# EasyEDA Pro project GD32F103C8T6 最小系统.eprj

# Schematic Schematic1
Create Date: 2024-03-24; Page Name: P1; Project Name: GD32F103C8T6 最小系统; Schematic Name: Schematic1; Update Date: 2024-04-14; Company: University of Leeds; Drawed: Junnan Liu; Page Size: A4; Version: V1.0
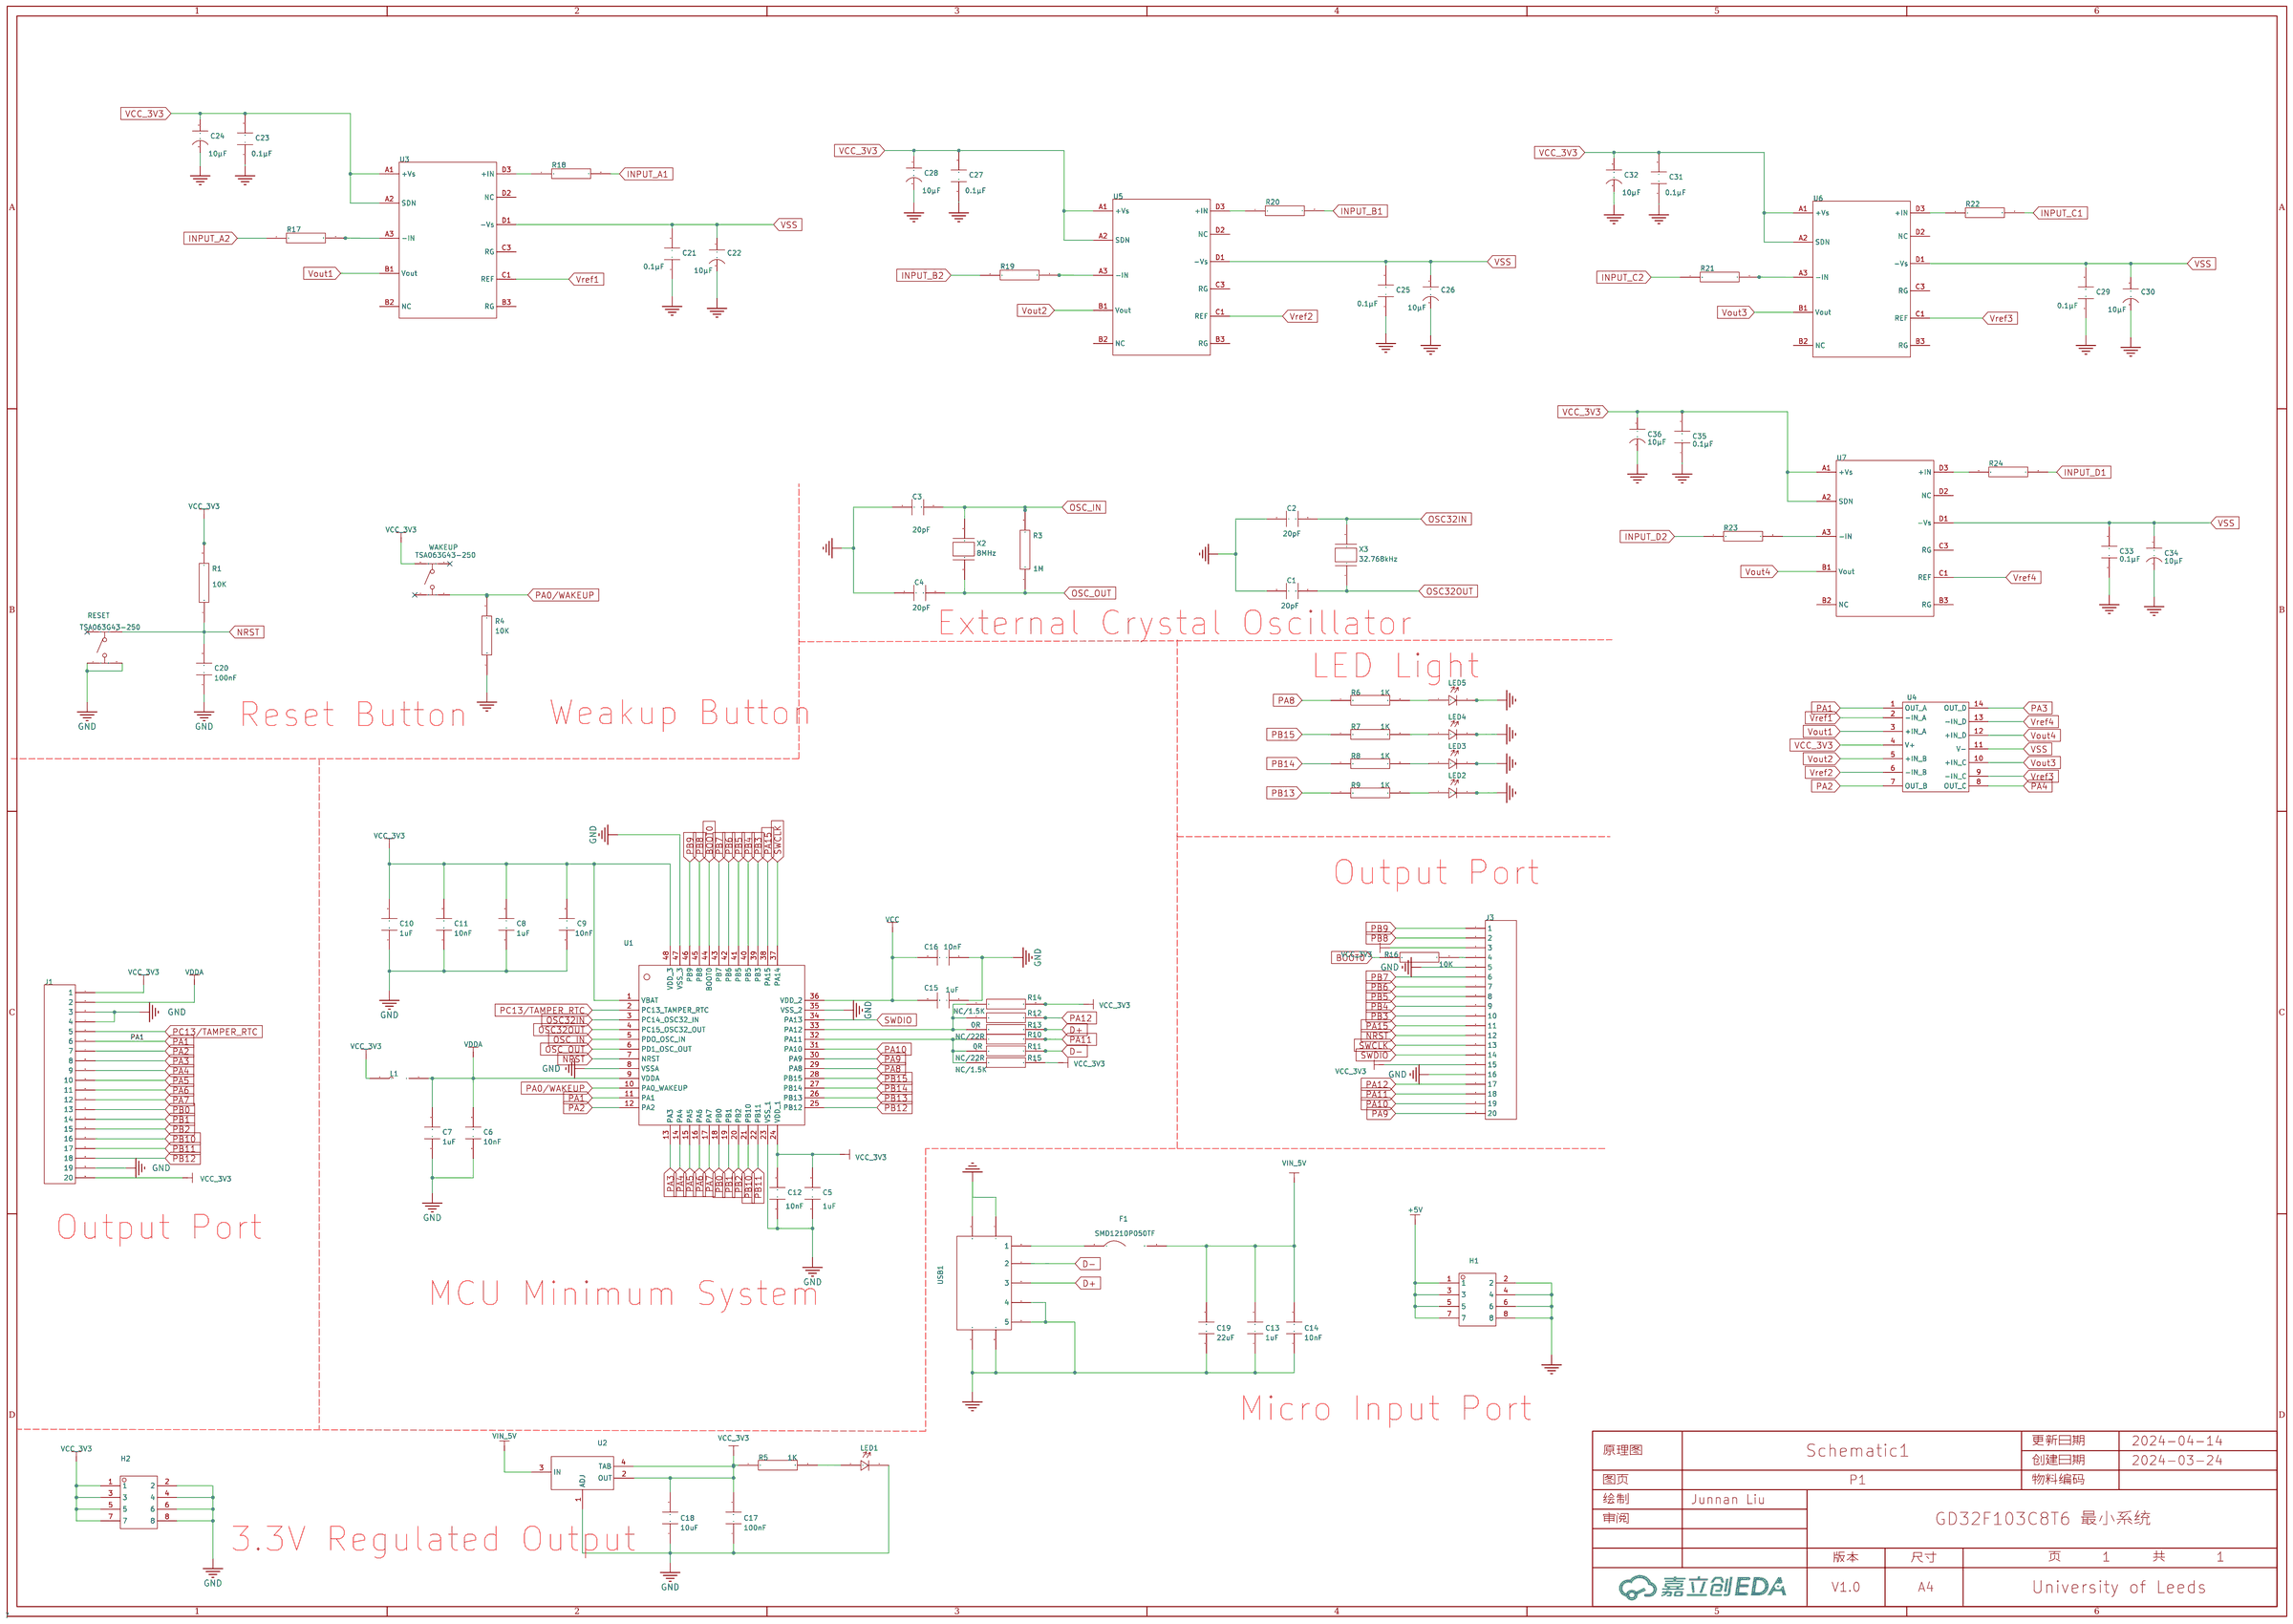
[diagram p0: schematic sheet]

## Parts
C1  20pF
C2  20pF
C3  20pF
C4  20pF
C5  1uF
C6  10nF
C7  1uF
C8  1uF
C9  10nF
C10  1uF
C11  10nF
C12  10nF
C13  1uF
C14  10nF
C15  1uF
C16  10nF
C17  100nF
C18  10uF
C19  22uF
C20  100nF
C21  0.1μF
C22  10μF
C23  0.1μF
C24  10μF
C25  0.1μF
C26  10μF
C27  0.1μF
C28  10μF
C29  0.1μF
C30  10μF
C31  0.1μF
C32  10μF
C33  0.1μF
C34  10μF
C35  0.1μF
C36  10μF
F1  SMD1210P050TF
H1  -
H2  -
J1  -
J3  -
L1  -
LED1  -
LED2  -
LED3  -
LED4  -
LED5  -
R1  10K
R3  1M
R4  10K
R5  1K
R6  1K
R7  1K
R8  1K
R9  1K
R10  0R
R11  NC/22R
R12  0R
R13  NC/22R
R14  NC/1.5K
R15  NC/1.5K
R16  10K
R17  -
R18  -
R19  -
R20  -
R21  -
R22  -
R23  -
R24  -
RESET  TSA063G43-250
U1  -
U2  -
U3  -
U4  -
U5  -
U6  -
U7  -
USB1  -
WAKEUP  TSA063G43-250
X2  8MHz
X3  32.768kHz

## Library data of the parts
C1-C21 C23 C25 C27 C29 C31 C33 C35 = C
C22 C24 C26 C28 C30 C32 C34 C36 = C1
F1 = F
H1 H2 = PZ254V-12-8P
J1 J3 = EXPIN_20
L1 = 3.3uH
LED1-LED5 = LED
R1 R3-R24 = R
RESET WAKEUP = KEY
U1 = GD32F103C876
U2 = AMS1117-3.3
U3 U5-U7 = AD8235
U4 = AD8619
USB1 = U-F-M5DD-Y-1
X2 X3 = 晶振

## Nets
+5V: H1.1 H1.3 H1.5 H1.7
GND: C1.1 C2.1 C3.1 C4.1 C5.1 C6.1 C7.1 C8.1 C9.1 C10.1 C11.1 C12.1 C13.1 C14.1 C15.1 C16.1 C17.1 C18.1 C19.1 C20.1 C21.1 C22.2 C23.1 C24.2 C25.1 C26.2 C27.1 C28.2 C29.1 C30.2 C31.1 C32.2 C33.1 C34.2 C35.1 C36.2 H1.2 H1.4 H1.6 H1.8 H2.2 H2.4 H2.6 H2.8 J1.3 J1.4 J1.19 J3.5 J3.16 LED1.2 LED2.2 LED3.2 LED4.2 LED5.2 R4.1(R-) RESET.3 RESET.4 U1.8(VSSA) U1.23(VSS_1) U1.35(VSS_2) U1.47(VSS_3) U2.1(ADJ) USB1.4 USB1.5 USB1.6 USB1.7 USB1.8 USB1.9
VCC: C15.2 C16.2 U1.36(VDD_2)
VCC_3V3: C5.2 C8.2 C9.2 C10.2 C11.2 C12.2 C17.2 C18.2 C23.2 C24.1 C27.2 C28.1 C31.2 C32.1 C35.2 C36.1 H2.1 H2.3 H2.5 H2.7 J1.1 J1.20 J3.3 J3.15 L1.1 R1.2(R+) R5.1(R-) R14.2(R+) R15.2(R+) U1.1(VBAT) U1.24(VDD_1) U1.48(VDD_3) U2.2(OUT) U2.4(TAB) U3.A1(+Vs) U3.A2(SDN) U4.4(V+) U5.A1(+Vs) U5.A2(SDN) U6.A1(+Vs) U6.A2(SDN) U7.A1(+Vs) U7.A2(SDN) WAKEUP.2
VDDA: C6.2 C7.2 J1.2 L1.2 U1.9(VDDA)
VIN_5V: C13.2 C14.2 C19.2 F1.2 U2.3(IN)
VSS: C21.2 C22.1 C25.2 C26.1 C29.2 C30.1 C33.2 C34.1 U3.D1(-Vs) U4.11(V-) U5.D1(-Vs) U6.D1(-Vs) U7.D1(-Vs)
BOOT0: R16.1(R-) U1.44(BOOT0)
D+: R13.2(R+) USB1.3
D-: R11.2(R+) USB1.2
INPUT_A1: R18.2(R+)
INPUT_A2: R17.1(R-)
INPUT_B1: R20.2(R+)
INPUT_B2: R19.1(R-)
INPUT_C1: R22.2(R+)
INPUT_C2: R21.1(R-)
INPUT_D1: R24.2(R+)
INPUT_D2: R23.1(R-)
NRST: C20.2 J3.12 R1.1(R-) RESET.1 U1.7(NRST)
OSC32IN: C2.2 U1.3(PC14_OSC32_IN) X3.2
OSC32OUT: C1.2 U1.4(PC15_OSC32_OUT) X3.1
OSC_IN: C3.2 R3.2(R+) U1.5(PDO_OSC_IN) X2.2
OSC_OUT: C4.2 R3.1(R-) U1.6(PD1_OSC_OUT) X2.1
PA0/WAKEUP: R4.2(R+) U1.10(PA0_WAKEUP) WAKEUP.3
PA1: J1.6 U1.11(PA1) U4.1(OUT A)
PA2: J1.7 U1.12(PA2) U4.7(OUT B)
PA3: J1.8 U1.13(PA3) U4.14(OUT D)
PA4: J1.9 U1.14(PA4) U4.8(OUT C)
PA5: J1.10 U1.15(PA5)
PA6: J1.11 U1.16(PA6)
PA7: J1.12 U1.17(PA7)
PA8: R6.1(R-) U1.29(PA8)
PA9: J3.20 U1.30(PA9)
PA10: J3.19 U1.31(PA10)
PA11: J3.18 R10.2(R+)
PA12: J3.17 R12.2(R+)
PA15: J3.11 U1.38(PA15)
PB0: J1.13 U1.18(PB0)
PB1: J1.14 U1.19(PB1)
PB2: J1.15 U1.20(PB2)
PB3: J3.10 U1.39(PB3)
PB4: J3.9 U1.40(PB5)
PB5: J3.8 U1.41(PB5)
PB6: J3.7 U1.42(PB6)
PB7: J3.6 U1.43(PB7)
PB8: J3.2 U1.45(PB8)
PB9: J3.1 U1.46(PB9)
PB10: J1.16 U1.21(PB10)
PB11: J1.17 U1.22(PB11)
PB12: J1.18 U1.25(PB12)
PB13: R9.1(R-) U1.26(PB13)
PB14: R8.1(R-) U1.27(PB14)
PB15: R7.1(R-) U1.28(PB15)
PC13/TAMPER_RTC: J1.5 U1.2(PC13_TAMPER_RTC)
SWCLK: J3.13 U1.37(PA14)
SWDIO: J3.14 U1.34(PA13)
Vout1: U3.B1(Vout) U4.3(+IN A)
Vout2: U4.5(+IN B) U5.B1(Vout)
Vout3: U4.10(+IN C) U6.B1(Vout)
Vout4: U4.12(+IN D) U7.B1(Vout)
Vref1: U3.C1(REF) U4.2(-IN A)
Vref2: U4.6(-IN B) U5.C1(REF)
Vref3: U4.9(-IN C) U6.C1(REF)
Vref4: U4.13(-IN D) U7.C1(REF)
Net-(F1-1): F1.1 USB1.1
Net-(J3-4): J3.4 R16.2(R+)
Net-(LED1-1): LED1.1 R5.2(R+)
Net-(LED2-1): LED2.1 R9.2(R+)
Net-(LED3-1): LED3.1 R8.2(R+)
Net-(LED4-1): LED4.1 R7.2(R+)
Net-(LED5-1): LED5.1 R6.2(R+)
Net-(R10-1): R10.1(R-) R11.1(R-) R15.1(R-) U1.32(PA11)
Net-(R12-1): R12.1(R-) R13.1(R-) R14.1(R-) U1.33(PA12)
Net-(R17-2): R17.2(R+) U3.A3(-IN)
Net-(R18-1): R18.1(R-) U3.D3(+IN)
Net-(R19-2): R19.2(R+) U5.A3(-IN)
Net-(R20-1): R20.1(R-) U5.D3(+IN)
Net-(R21-2): R21.2(R+) U6.A3(-IN)
Net-(R22-1): R22.1(R-) U6.D3(+IN)
Net-(R23-2): R23.2(R+) U7.A3(-IN)
Net-(R24-1): R24.1(R-) U7.D3(+IN)

Not connected (* = marked no-connect by the designer): RESET 2*; U3 B2(NC) B3(RG) C3(RG) D2(NC); U5 B2(NC) B3(RG) C3(RG) D2(NC); U6 B2(NC) B3(RG) C3(RG) D2(NC); U7 B2(NC) B3(RG) C3(RG) D2(NC); WAKEUP 1* 4*

## Notes on the sheet
- External Crystal Oscillator
- LED Light
- Reset Button
- Weakup Button
- Output Port
- Output Port
- MCU Minimum System
- Micro Input Port
- 3.3V Regulated Output
